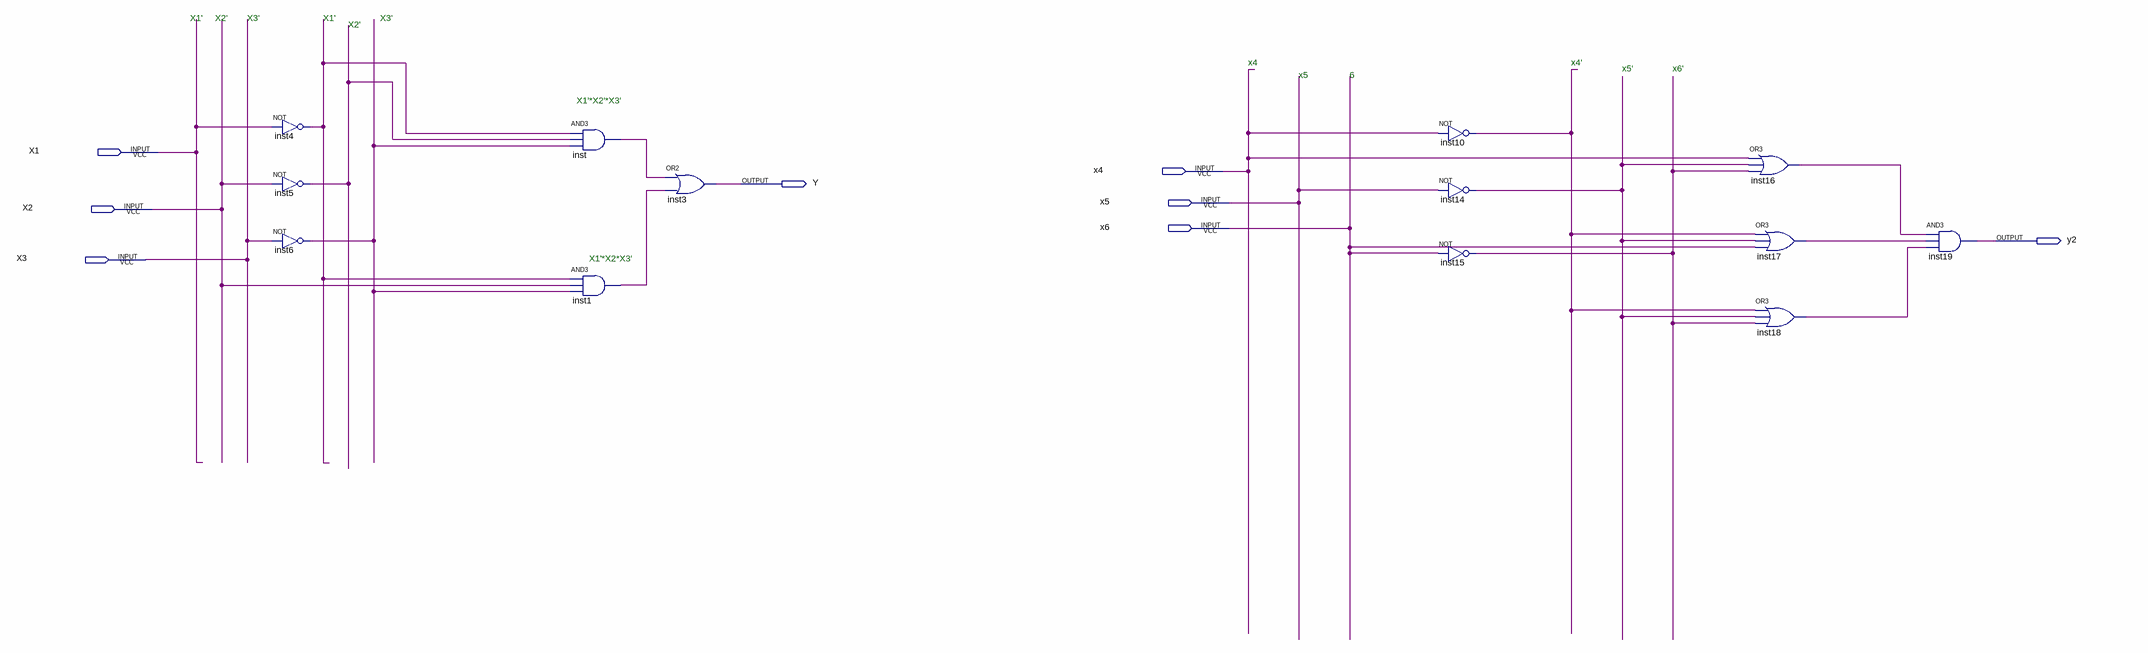
[diagram p0: schematic sheet]
// Quartus schematic functions.bdf as structural Verilog: 13 symbols, 8 pins
module functions (
  input  X1,
  input  x4,
  input  x5,
  input  X2,
  input  x6,
  input  X3,
  output Y,
  output y2
);

  wire inst1_out, inst4_out, inst5_out, inst6_out, inst10_out, inst14_out, inst15_out, inst16_out,
       inst17_out, inst18_out, inst_out;

  not inst4 (inst4_out, X1);
  not inst5 (inst5_out, X2);
  not inst6 (inst6_out, X3);
  and inst (inst_out, inst4_out, inst5_out, inst6_out);
  and inst1 (inst1_out, inst4_out, X2, inst6_out);
  or inst3 (Y, inst_out, inst1_out);
  not inst10 (inst10_out, x4);
  not inst14 (inst14_out, x5);
  not inst15 (inst15_out, x6);
  or inst16 (inst16_out, x4, inst14_out, inst15_out);
  or inst17 (inst17_out, inst10_out, inst14_out, x6);
  or inst18 (inst18_out, inst10_out, inst14_out, inst15_out);
  and inst19 (y2, inst16_out, inst17_out, inst18_out);

  // Notes on the sheet:
  //   X1'
  //   X2'
  //   X3'
  //   X1'
  //   X3'
  //   X2'
  //   x4
  //   x4'
  //   x5'
  //   x6'
  //   x5
  //   6
  //   X1'*X2'*X3'
  //   X1'*X2*X3'
endmodule
